# Altium schematic sheet Digital.SchDoc
size 381 x 241 mm; SheetNumber: 2; SheetTotal: 2
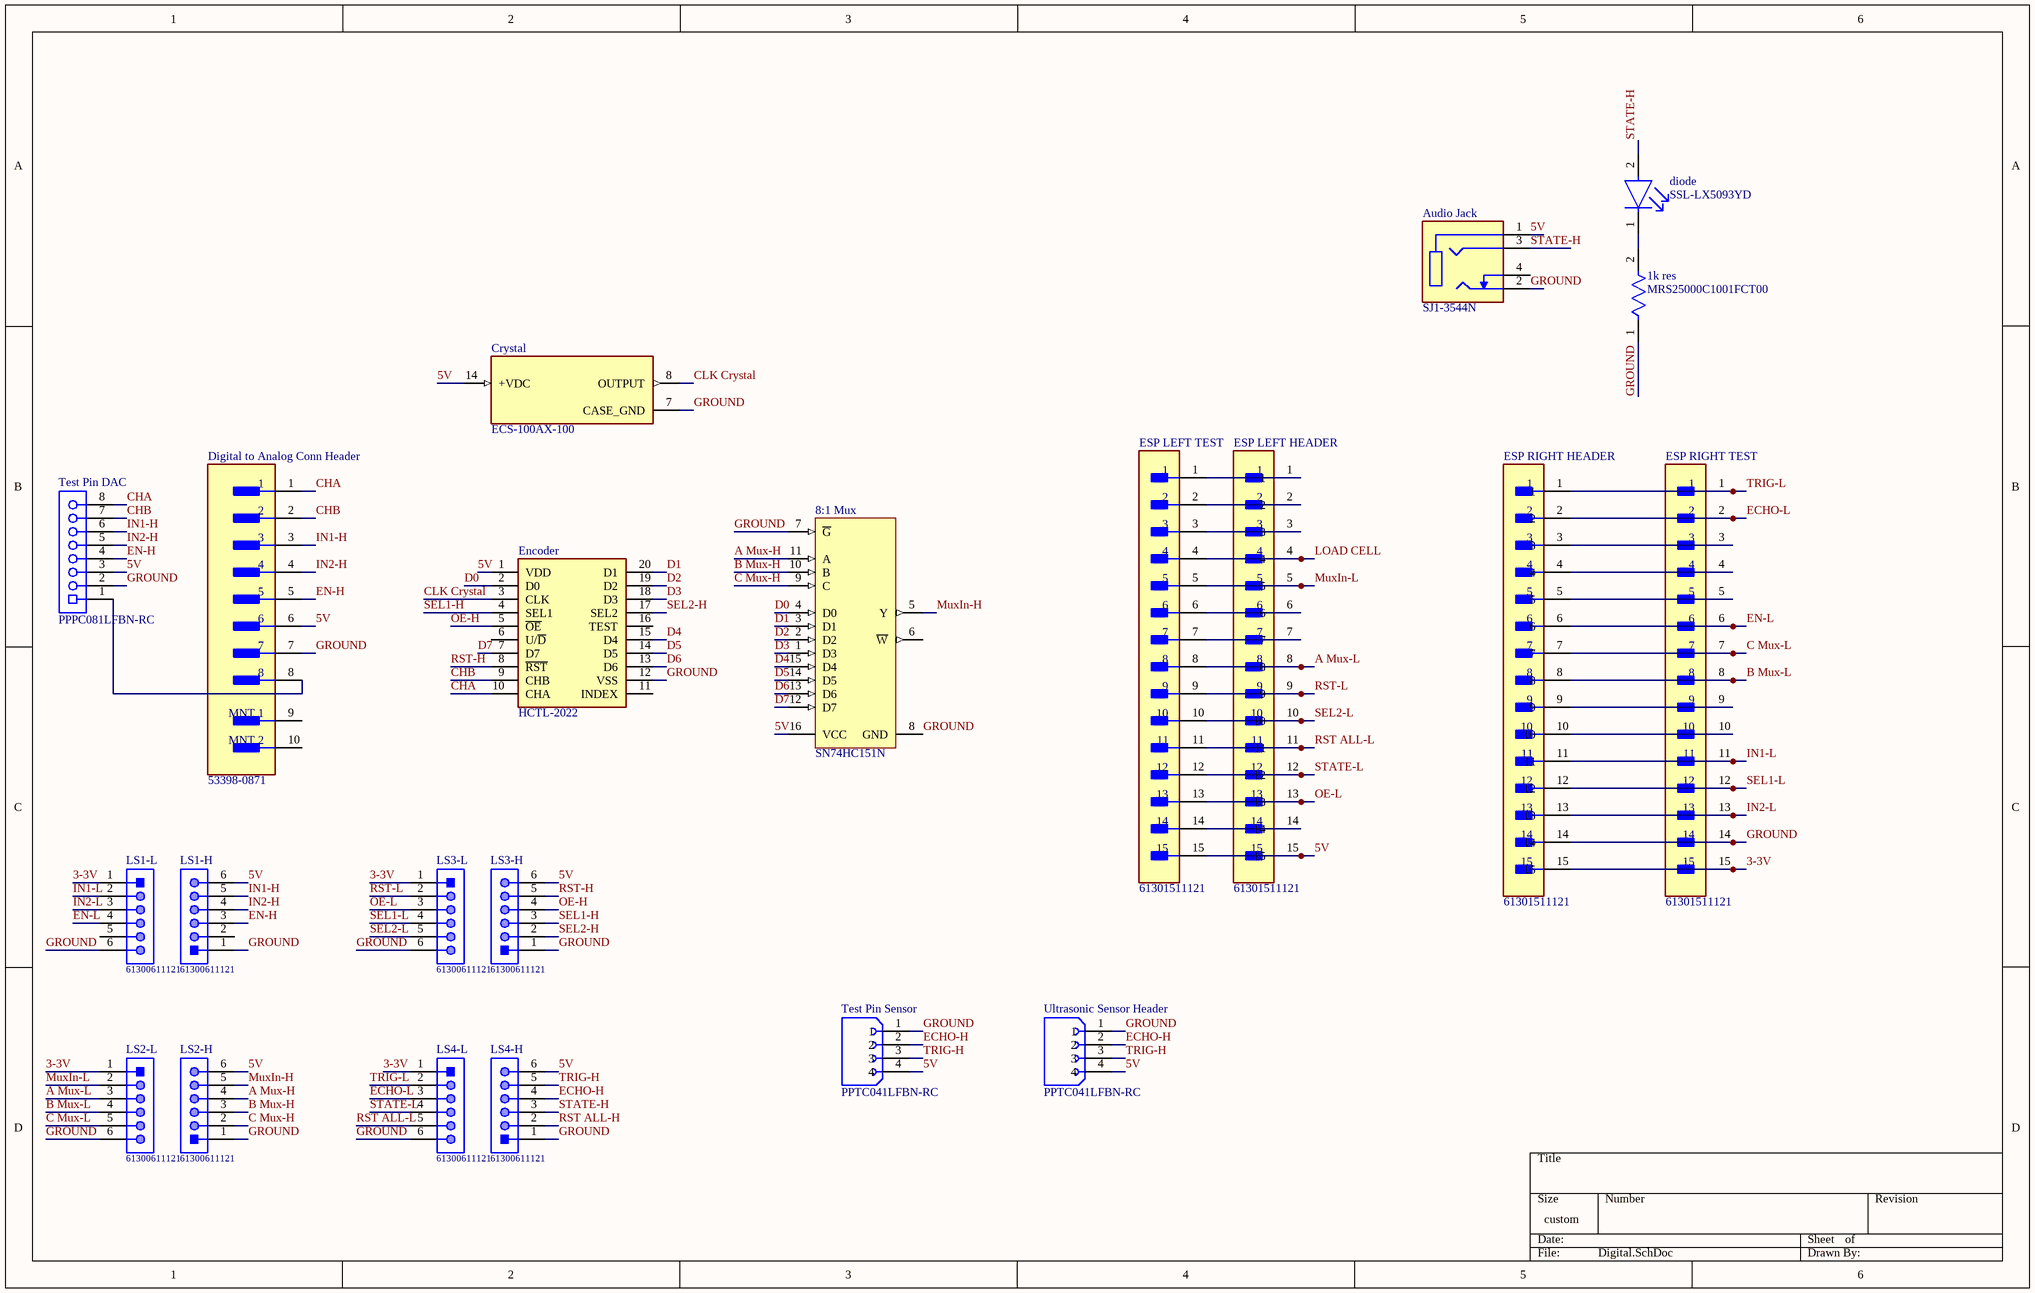
[diagram p0: Digital.SchDoc]

## Parts
1k_res  MRS25000C1001FCT00  [FP-MRS25-MFG]
8:1_Mux  SN74HC151N  [N0016A]
Audio_Jack  SJ1-3544N  [CUI_SJ1-3544N]
Crystal  ECS-100AX-100  [OSC_ECS-100AX-100]
Digital_to_Analog_Conn_Header  53398-0871  [FP-53398-0871-MFG]
diode  SSL-LX5093YD  [FP-SSL-LX5093YD-MFG]
Encoder  HCTL-2022  [DIP762W56P254L2591H330Q20N]
ESP_LEFT_HEADER  61301511121  [FP-61301511121-MFG]
ESP_LEFT_TEST  61301511121  [FP-61301511121-MFG]
ESP_RIGHT_HEADER  61301511121  [FP-61301511121-MFG]
ESP_RIGHT_TEST  61301511121  [FP-61301511121-MFG]
LS1-H  61300611121  [61300611121]
LS1-L  61300611121  [61300611121]
LS2-H  61300611121  [61300611121]
LS2-L  61300611121  [61300611121]
LS3-H  61300611121  [61300611121]
LS3-L  61300611121  [61300611121]
LS4-H  61300611121  [61300611121]
LS4-L  61300611121  [61300611121]
Test_Pin_DAC  PPPC081LFBN-RC  [SLIN-PPPC081LFBN-RC_V]
Test_Pin_Sensor  PPTC041LFBN-RC  [SULLINS_PPTC041LFBN-RC]
Ultrasonic_Sensor_Header  PPTC041LFBN-RC  [SULLINS_PPTC041LFBN-RC]

## Nets
3-3V: ESP_RIGHT_HEADER.15 ESP_RIGHT_TEST.15 LS1-L.1 LS2-L.1 LS3-L.1 LS4-L.1
5V: 8:1_Mux.16(VCC) Audio_Jack.1 Crystal.14(+VDC) Digital_to_Analog_Conn_Header.6 Encoder.1(VDD) ESP_LEFT_HEADER.15 ESP_LEFT_TEST.15 LS1-H.6 LS2-H.6 LS3-H.6 LS4-H.6 Test_Pin_DAC.3 Test_Pin_Sensor.4 Ultrasonic_Sensor_Header.4
A Mux-H: 8:1_Mux.11(A) LS2-H.4
A Mux-L: ESP_LEFT_HEADER.8 ESP_LEFT_TEST.8 LS2-L.3
B Mux-H: 8:1_Mux.10(B) LS2-H.3
B Mux-L: ESP_RIGHT_HEADER.8 ESP_RIGHT_TEST.8 LS2-L.4
C Mux-H: 8:1_Mux.9(C) LS2-H.2
C Mux-L: ESP_RIGHT_HEADER.7 ESP_RIGHT_TEST.7 LS2-L.5
CHA: Digital_to_Analog_Conn_Header.1 Encoder.10(CHA) Test_Pin_DAC.8
CHB: Digital_to_Analog_Conn_Header.2 Encoder.9(CHB) Test_Pin_DAC.7
CLK Crystal: Crystal.8(OUTPUT) Encoder.3(CLK)
D0: 8:1_Mux.4(D0) Encoder.2(D0)
D1: 8:1_Mux.3(D1) Encoder.20(D1)
D2: 8:1_Mux.2(D2) Encoder.19(D2)
D3: 8:1_Mux.1(D3) Encoder.18(D3)
D4: 8:1_Mux.15(D4) Encoder.15(D4)
D5: 8:1_Mux.14(D5) Encoder.14(D5)
D6: 8:1_Mux.13(D6) Encoder.13(D6)
D7: 8:1_Mux.12(D7) Encoder.7(D7)
ECHO-H: LS4-H.4 Test_Pin_Sensor.2 Ultrasonic_Sensor_Header.2
ECHO-L: ESP_RIGHT_HEADER.2 ESP_RIGHT_TEST.2 LS4-L.3
EN-H: Digital_to_Analog_Conn_Header.5 LS1-H.3 Test_Pin_DAC.4
EN-L: ESP_RIGHT_HEADER.6 ESP_RIGHT_TEST.6 LS1-L.4
GROUND: 1k_res.1 8:1_Mux.7(~{G}) 8:1_Mux.8(GND) Audio_Jack.2 Crystal.7(CASE_GND) Digital_to_Analog_Conn_Header.7 Encoder.12(VSS) ESP_RIGHT_HEADER.14 ESP_RIGHT_TEST.14 LS1-H.1 LS1-L.6 LS2-H.1 LS2-L.6 LS3-H.1 LS3-L.6 LS4-H.1 LS4-L.6 Test_Pin_DAC.2 Test_Pin_Sensor.1 Ultrasonic_Sensor_Header.1
IN1-H: Digital_to_Analog_Conn_Header.3 LS1-H.5 Test_Pin_DAC.6
IN1-L: ESP_RIGHT_HEADER.11 ESP_RIGHT_TEST.11 LS1-L.2
IN2-H: Digital_to_Analog_Conn_Header.4 LS1-H.4 Test_Pin_DAC.5
IN2-L: ESP_RIGHT_HEADER.13 ESP_RIGHT_TEST.13 LS1-L.3
LOAD CELL: ESP_LEFT_HEADER.4 ESP_LEFT_TEST.4
MuxIn-H: 8:1_Mux.5(Y) LS2-H.5
MuxIn-L: ESP_LEFT_HEADER.5 ESP_LEFT_TEST.5 LS2-L.2
OE-H: Encoder.5(~{OE}) LS3-H.4
OE-L: ESP_LEFT_HEADER.13 ESP_LEFT_TEST.13 LS3-L.3
RST ALL-H: LS4-H.2
RST ALL-L: ESP_LEFT_HEADER.11 ESP_LEFT_TEST.11 LS4-L.5
RST-H: Encoder.8(~{RST}) LS3-H.5
RST-L: ESP_LEFT_HEADER.9 ESP_LEFT_TEST.9 LS3-L.2
SEL1-H: Encoder.4(SEL1) LS3-H.3
SEL1-L: ESP_RIGHT_HEADER.12 ESP_RIGHT_TEST.12 LS3-L.4
SEL2-H: Encoder.17(SEL2) LS3-H.2
SEL2-L: ESP_LEFT_HEADER.10 ESP_LEFT_TEST.10 LS3-L.5
STATE-H: Audio_Jack.3 diode.2(A) LS4-H.3
STATE-L: ESP_LEFT_HEADER.12 ESP_LEFT_TEST.12 LS4-L.4
TRIG-H: LS4-H.5 Test_Pin_Sensor.3 Ultrasonic_Sensor_Header.3
TRIG-L: ESP_RIGHT_HEADER.1 ESP_RIGHT_TEST.1 LS4-L.2
Net1k_res_2: 1k_res.2 diode.1(C)
NetDigital_to_Analog_Conn_Header_8: Digital_to_Analog_Conn_Header.8 Test_Pin_DAC.1
NetESP_LEFT_HEADER_1: ESP_LEFT_HEADER.1 ESP_LEFT_TEST.1
NetESP_LEFT_HEADER_2: ESP_LEFT_HEADER.2 ESP_LEFT_TEST.2
NetESP_LEFT_HEADER_3: ESP_LEFT_HEADER.3 ESP_LEFT_TEST.3
NetESP_LEFT_HEADER_6: ESP_LEFT_HEADER.6 ESP_LEFT_TEST.6
NetESP_LEFT_HEADER_7: ESP_LEFT_HEADER.7 ESP_LEFT_TEST.7
NetESP_LEFT_HEADER_14: ESP_LEFT_HEADER.14 ESP_LEFT_TEST.14
NetESP_RIGHT_HEADER_3: ESP_RIGHT_HEADER.3 ESP_RIGHT_TEST.3
NetESP_RIGHT_HEADER_4: ESP_RIGHT_HEADER.4 ESP_RIGHT_TEST.4
NetESP_RIGHT_HEADER_5: ESP_RIGHT_HEADER.5 ESP_RIGHT_TEST.5
NetESP_RIGHT_HEADER_9: ESP_RIGHT_HEADER.9 ESP_RIGHT_TEST.9
NetESP_RIGHT_HEADER_10: ESP_RIGHT_HEADER.10 ESP_RIGHT_TEST.10

Not connected (* = marked no-connect by the designer): 8:1_Mux 6(~{W}); Audio_Jack 4; Digital_to_Analog_Conn_Header 9(MNT_1) 10(MNT_2); Encoder 6(U/~{D}) 11(INDEX) 16(TEST); LS1-H 2; LS1-L 5

## Library data of the parts
1k_res = CMP-02408-000051-1: RES 1K OHM 0.6W 1% AXIAL; Power Rating: 600mW; Lead Diameter: 0.6mm; Voltage Rating (DC): 350V; Resistance: 1kR; Temperature Coefficient: 50ppm/°C; Width: 2.5mm; Military Standard: Not; Package Quantity: 5000; Radiation Hardening: No; Case/Package: Axial; Resistance Tolerance: 1%; Resistor Type: Metal Film; Contact Plating: Tin; Length: 6.5mm; Lead Free: Lead Free; RoHS Compliant: Yes; Mount: Through Hole; Number of Pins: 2; Technology: THIN FILM; Voltage Rating: 350V; Min Operating Temperature: -55°C; Weight: 0.00776oz; Diameter: 2.5mm; Construction: Cylindrical; Series: MRS25; Tolerance: 1%; Packaging: Tape and Reel; Max Operating Temperature: 155°C; Max Power Dissipation: 600mW; Number of Terminations: 2; Termination: Axial
8:1_Mux = CMP-1628-00023-2: 8-Line To 1-Line Data Selectors/Multiplexers, N0016A, TUBE; Manufacturer: Texas Instruments; VCC(Max)(V): 6; tpd @ Nom Voltage(Max)(ns): 63; Configuration: 8：1; Rating: Catalog; Bits(#): 8; Function: Encoder/Multiplexer; Voltage(Nom)(V): 3.3,5; Input Type: LVTTL/CMOS; Technology Family: HC; ICC @ Nom Voltage(Max)(mA): 0.08; Output Type: CMOS; Channels(#): 1; F @ Nom Voltage(Max)(Mhz): 28; Schmitt Trigger: No; Output Drive (IOL/IOH)(Max)(mA): 7.8/-7.8; VCC(Min)(V): 2; PackageReference: N0016A; Type: Standard; Generic Part Number: SN74HC151; DatasheetVersion: SCLS110E; Code_JEDEC: MS-001; Operating Temperature Range(C): -40 to 85
Audio_Jack = SJ1-3544N: 3.5 mm Right-Angle Stereo Jack, 4 Pin PCB Mount, Non-Threaded; Package: None; Price: None; MP: SJ1-3544N; Availability: Unavailable; Value: *
Crystal = ECS-100AX-100: Oscillator  14-DIP, 4 Leads (Full Size, Metal Can); Package: None; Price: None; Value: *; MP: ECS-100AX-100; Availability: Unavailable
Digital_to_Analog_Conn_Header = CMP-04776-000009-1: CONN HEADER SMD 8POS 1.25MM; Manufacturer: Molex; Current Rating: 1A; Conn Gender: Male; Number Of Contacts: 8; Standoff Height: 0.05mm; Voltage Rating: 125V; Conn Orientation: Vertical; Package: 0; Lead Free: Yes; Number Of Rows: 1; Device Class L1: Connectors; Pitch: 1.25mm; Temperature Range High: +105°C; Automotive: No; ComponentLink2Description: Datasheet; Temperature Range Low: -40°C; RoHS: TRUE; Mouser Description: Headers & Wire Housings VERTICAL HDR SMT 8P; Ambient Temperature Range Low: -40°C; Octopart: https://octopart.com/53398-0871-molex-655298; Device Class L2: Headers and Wire Housings; Temperature: -40°C to +105°C; Footprint Url: https://www.molex.com/pdm_docs/sd/533980871_sd.pdf; Device Class L3: unset; ComponentLink2URL: https://www.molex.com/pdm_docs/ps/PS-51021-024-001.pdf; Contact Material: Tin,Nickel; Ambient Temperature Range High: +105°C; Height: 4.9mm; Manufacturer Part Number: 53398-0871; Digikey Description: CONN HEADER SMD 8POS 1.25MM; Category: Conn
diode = CMP-57192-000007-1: LED YELLOW DIFFUSED T-1 3/4 T/H; Test Current: 20mA; Number of LEDs: 1; Dominant Wavelength: 568nm; Wavelength: 585nm; Forward Voltage: 2.1V; Lens Style: Dome; Viewing Angle: 60°; Luminous Intensity: 30mcd; Min Operating Temperature: -40°C; Packaging: Bulk; Width: 1.5inch; Lead Free: Lead Free; Number of Pins: 2; Color: Yellow; Case/Package: Radial; Forward Current: 20mA; REACH SVHC: No SVHC; Lens Transparency: Diffused; Weight: 0.01lb; Height: 8.6mm; Package Quantity: 1000; Series: -; Length: 0.5inch; Illumination Color: Yellow; Mount: Through Hole; Diameter: 5mm; RoHS Compliant: Yes; Lens Color: Yellow; Max Operating Temperature: 85°C
Encoder = HCTL-2022: HCTL-2022 quadrature decoder/counter ic Avago Technologies HCTL-2022 Decoder, 20-Pin PDIP; Geometry.Height: 3.302mm; Mouser Part Number: 630-HCTL-2022; Mouser Price/Stock: https://www.mouser.com/Search/Refine.aspx?Keyword=630-HCTL-2022; Manufacturer_Name: Avago Technologies; Manufacturer_Part_Number: HCTL-2022; Datasheet Link: https://datasheet.datasheetarchive.com/originals/distributors/Datasheets-2/DSA-25498.pdf
ESP_LEFT_HEADER ESP_LEFT_TEST ESP_RIGHT_HEADER ESP_RIGHT_TEST = CMP-207987-000006-1: CONN HEADER VERT 15POS 2.54MM; Voltage Rating: 250V; Pitch: 0.1inch; Gender: Male; Number of Positions: 15; Mount: Through Hole; Connector Type: Header; Insulation Color: Black; Contact Material: Copper Alloy; Color: Black; Flammability Rating: UL94 V-0; Min Operating Temperature: -40°C; RoHS Compliant: Yes; Termination: Solder; Packaging: Bulk; Series: WR-PHD; Contact Shape: Square; Contact Plating: Gold; Contact Mating Length: 0.236inch; Number of Rows: 1; Fastening Type: Pull; Contact Type: Male Pin; Contact Finish - Mating: GOLD; Insulation Material: Nylon; Number of Contacts: 15; Max Operating Temperature: 105°C
LS1-H LS1-L LS2-H LS2-L LS3-H LS3-L LS4-H LS4-L = CMP-1502-01070-1: THT Vertical Pin Header WR-PHD, Pitch 2.54 mm, Single Row, 6 pins; Manufacturer: Wurth Elektronik; Gender: Male; Pin Number: 6; Pitch: 2.54mm; Working Voltage: 250VAC; Rated Current: 3A; Withstanding Voltage: 500VAC; Contact Resistance: 20mOhm; Operating Temperature: -40to105degC; Packaging: Bag; Datasheet URL: https://katalog.we-online.de/em/datasheet/6130xx11121.pdf; Package Reference: 61300611121; Mounting Technology: THT; Publisher: WurthElektronik; Part Number: 61300611121; Manufacturer URL: http://www.we-online.de; Row Number: Single; Orientation: Vertical
Test_Pin_DAC = CMP-1770-00002-1: Female Header, Pitch 2.54 mm, 1 x 8 Position, Height 8.5 mm, Tail Length 3.2 mm, -40 to 105 degC, RoHS, Bulk; Case\Package: TO-252-3; Rds On Max: 115 mohm; Typical Rise Time: 90 ns; Max Power Dissipation: 2.5 W; Input Capacitance: 350 pF; Elements: 1; Height: 2.39 mm; Min Operating Temperature: -55 degC; RoHSCompliant: true; PackageDescription: Female Header, Pitch 2.54 mm, 1 x 8 Position, Height 8.5 mm, Tail Length 3.2 mm; Length: 6.73 mm; ComponentLink1Description: Datasheet; Package Quantity: 2500; Max Operating Temperature: 150 degC; Width: 6.22 mm; Radiation Hardening: No; Packaging: Tape and Reel; REACH SVHC: No SVHC; Pins: 3; PackageReference: PPPC081LFBN-RC; ComponentLink1URL: http://sullinscorp.com/catalogs/101_PAGE114-115_.100_FEMALE_HDR.pdf; DatasheetVersion: Jan-15; Mount: Surface Mount
Test_Pin_Sensor Ultrasonic_Sensor_Header = PPTC041LFBN-RC: 4 Position Header Connector 0.100 (2.54mm) Through Hole Tin; MF: Sullins Connector; Purchase-URL: https://pricing.snapeda.com/search/part/PPTC041LFBN-RC/?ref=eda; Check_prices: https://www.snapeda.com/parts/PPTC041LFBN-RC/Sullins+Connector+Solutions/view-part/?ref=eda; Package: None; SnapEDA_Link: https://www.snapeda.com/parts/PPTC041LFBN-RC/Sullins+Connector+Solutions/view-part/?ref=snap; Value: *; MP: PPTC041LFBN-RC; Digi-Key_Part_Number: S7002-ND